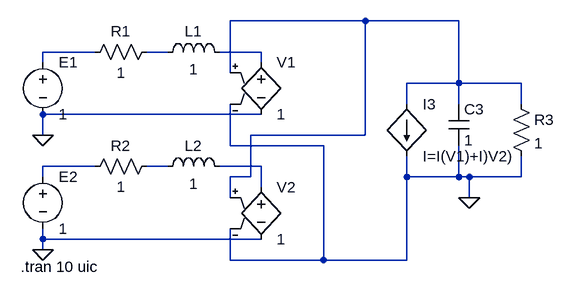
[diagram p0: schematic transformer.asc]
transformer.asc, the LTspice schematic file:
Version 4
SHEET 1 880 680
WIRE 480 0 272 0
WIRE 624 0 480 0
WIRE 64 48 -16 48
WIRE 176 48 144 48
WIRE 320 48 256 48
WIRE -16 64 -16 48
WIRE 320 64 320 48
WIRE 272 80 272 0
WIRE 624 96 624 0
WIRE 624 96 544 96
WIRE 720 96 624 96
WIRE 544 128 544 96
WIRE 624 128 624 96
WIRE 720 128 720 96
WIRE 320 144 -16 144
WIRE -16 176 -16 144
WIRE 480 176 480 0
WIRE 480 176 304 176
WIRE 272 192 272 128
WIRE 416 192 272 192
WIRE 64 224 -16 224
WIRE 176 224 144 224
WIRE 320 224 256 224
WIRE -16 240 -16 224
WIRE 304 240 304 176
WIRE 304 240 272 240
WIRE 544 240 544 208
WIRE 624 240 624 192
WIRE 624 240 544 240
WIRE 640 240 624 240
WIRE 720 240 720 208
WIRE 720 240 640 240
WIRE 320 256 320 224
WIRE 272 272 272 240
WIRE 640 272 640 240
WIRE -16 336 -16 320
WIRE 320 336 -16 336
WIRE -16 352 -16 336
WIRE 272 368 272 320
WIRE 416 368 416 192
WIRE 416 368 272 368
WIRE 544 368 544 240
WIRE 544 368 416 368
FLAG 640 272 0
FLAG -16 176 0
FLAG -16 352 0
SYMBOL voltage -16 48 R0
WINDOW 123 0 0 Left 0
WINDOW 39 0 0 Left 0
SYMATTR InstName E1
SYMATTR Value 1
SYMBOL voltage -16 224 R0
WINDOW 123 0 0 Left 0
WINDOW 39 0 0 Left 0
SYMATTR InstName E2
SYMATTR Value 1
SYMBOL res 160 32 R90
WINDOW 0 0 56 VBottom 2
WINDOW 3 32 56 VTop 2
SYMATTR InstName R1
SYMATTR Value 1
SYMBOL res 160 208 R90
WINDOW 0 0 56 VBottom 2
WINDOW 3 32 56 VTop 2
SYMATTR InstName R2
SYMATTR Value 1
SYMBOL ind 160 64 R270
WINDOW 0 32 56 VTop 2
WINDOW 3 5 56 VBottom 2
SYMATTR InstName L1
SYMATTR Value 1
SYMBOL ind 160 240 R270
WINDOW 0 32 56 VTop 2
WINDOW 3 5 56 VBottom 2
SYMATTR InstName L2
SYMATTR Value 1
SYMBOL cap 608 128 R0
SYMATTR InstName C3
SYMATTR Value 1
SYMBOL res 704 112 R0
SYMATTR InstName R3
SYMATTR Value 1
SYMBOL e 320 48 R0
SYMATTR InstName V1
SYMATTR Value 1
SYMBOL e 320 240 R0
SYMATTR InstName V2
SYMATTR Value 1
SYMBOL bi 544 128 R0
SYMATTR InstName I3
SYMATTR Value I=I(V1)+I)V2)
TEXT -50 378 Left 2 !.tran 10 uic

The netlist it stands for:
* transformer.asc
V§E1 N002 0 1
V§E2 N005 0 1
R1 N003 N002 1
R2 N006 N005 1
L1 N003 N004 1
L2 N006 N007 1
C3 N001 0 1
R3 N001 0 1
E§V1 N004 0 N001 0 1
E§V2 N007 0 N001 0 1
B§I3 N001 0 I=I(V1)+I)V2)
.tran 10 uic
.backanno
.end